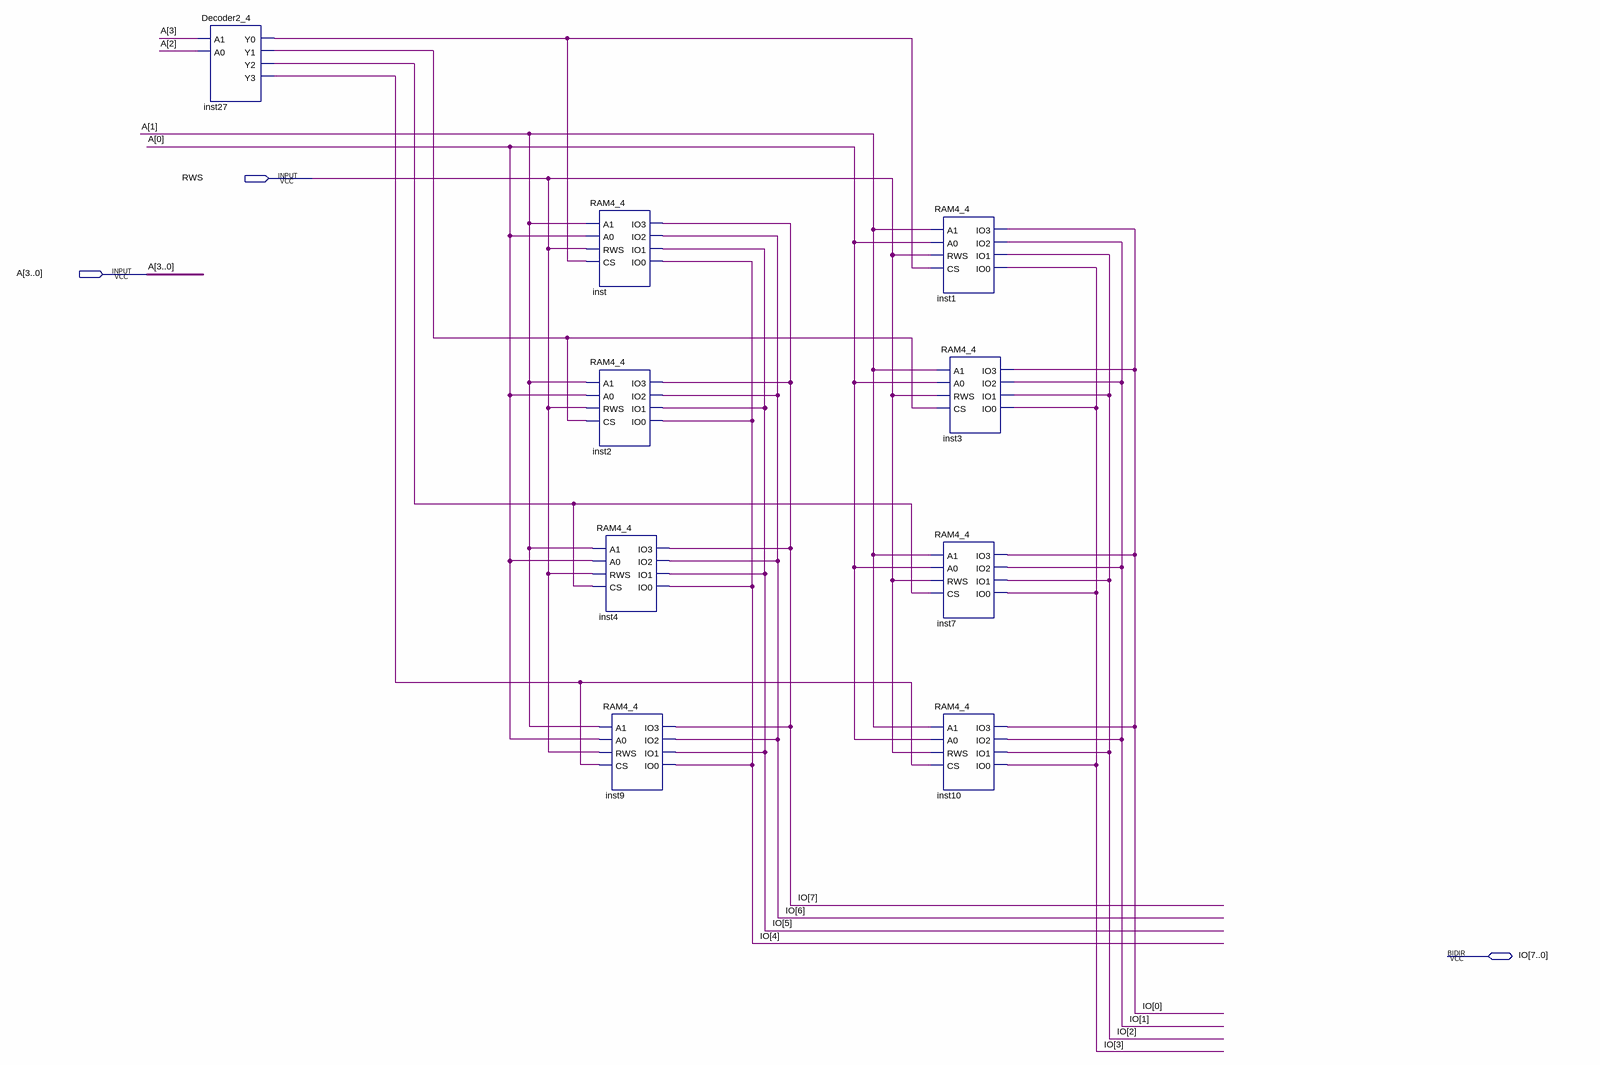
[diagram p0: schematic sheet]
// Quartus schematic RAM16_8.bdf as structural Verilog: 9 symbols, 3 pins
module RAM16_8 (
  input  RWS,
  input  [3:0] A,
  inout  [7:0] IO
);

  wire inst27_y0, inst27_y1, inst27_y2, inst27_y3;

  Decoder2_4 inst27 (.A1(A[3]), .A0(A[2]), .Y0(inst27_y0), .Y1(inst27_y1), .Y2(inst27_y2), .Y3(inst27_y3));
  RAM4_4 inst (.A1(A[1]), .A0(A[0]), .RWS(RWS), .CS(inst27_y0), .IO3(IO[7]), .IO2(IO[6]), .IO1(IO[5]), .IO0(IO[4]));
  RAM4_4 inst2 (.A1(A[1]), .A0(A[0]), .RWS(RWS), .CS(inst27_y1), .IO3(IO[7]), .IO2(IO[6]), .IO1(IO[5]), .IO0(IO[4]));
  RAM4_4 inst4 (.A1(A[1]), .A0(A[0]), .RWS(RWS), .CS(inst27_y2), .IO3(IO[7]), .IO2(IO[6]), .IO1(IO[5]), .IO0(IO[4]));
  RAM4_4 inst9 (.A1(A[1]), .A0(A[0]), .RWS(RWS), .CS(inst27_y3), .IO3(IO[7]), .IO2(IO[6]), .IO1(IO[5]), .IO0(IO[4]));
  RAM4_4 inst1 (.A1(A[1]), .A0(A[0]), .RWS(RWS), .CS(inst27_y0), .IO3(IO[0]), .IO2(IO[1]), .IO1(IO[2]), .IO0(IO[3]));
  RAM4_4 inst3 (.A1(A[1]), .A0(A[0]), .RWS(RWS), .CS(inst27_y1), .IO3(IO[0]), .IO2(IO[1]), .IO1(IO[2]), .IO0(IO[3]));
  RAM4_4 inst7 (.A1(A[1]), .A0(A[0]), .RWS(RWS), .CS(inst27_y2), .IO3(IO[0]), .IO2(IO[1]), .IO1(IO[2]), .IO0(IO[3]));
  RAM4_4 inst10 (.A1(A[1]), .A0(A[0]), .RWS(RWS), .CS(inst27_y3), .IO3(IO[0]), .IO2(IO[1]), .IO1(IO[2]), .IO0(IO[3]));
endmodule
